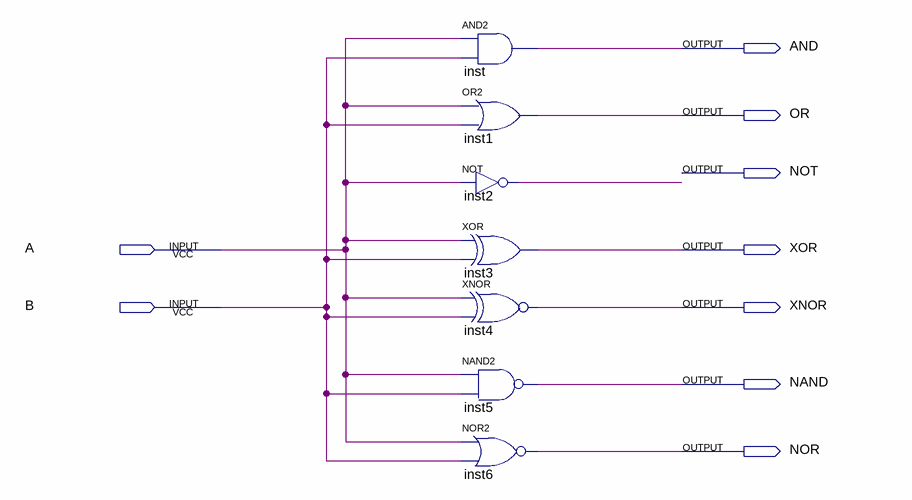
[diagram p0: schematic sheet]
// Quartus schematic LAB01_TL.bdf as structural Verilog: 7 symbols, 9 pins
module LAB01_TL (
  input  A,
  input  B,
  output AND,
  output OR,
  output NOT,
  output XOR,
  output XNOR,
  output NAND,
  output NOR
);

  wire inst2_out;

  and inst (AND, A, B);
  or inst1 (OR, A, B);
  not inst2 (inst2_out, A);
  xor inst3 (XOR, A, B);
  xnor inst4 (XNOR, A, B);
  nand inst5 (NAND, A, B);
  nor inst6 (NOR, A, B);
endmodule
